# EAGLE design first_draft_schematic (EAGLE 7.2.0)
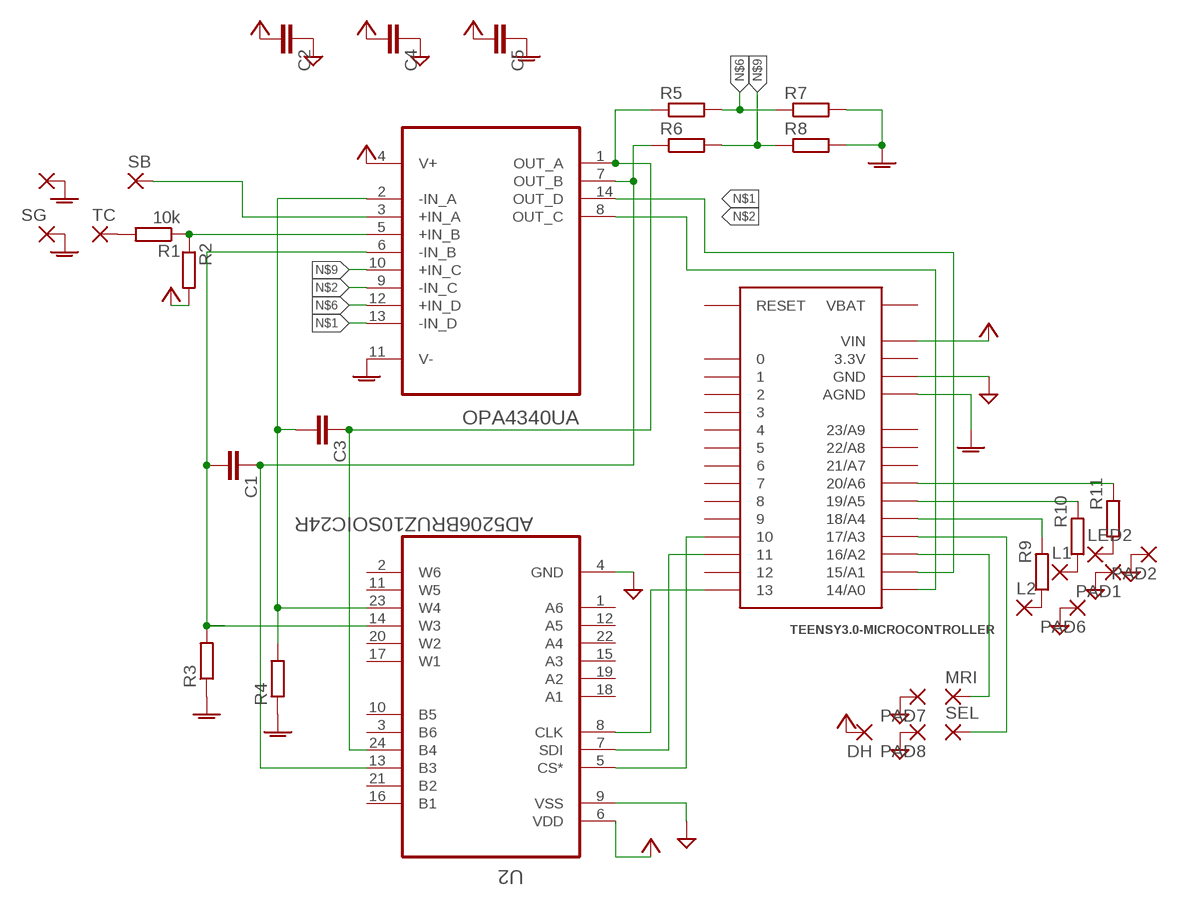
[diagram p0: schematic, sheet 1]

## Parts
C1  10pF  C-EUC0805  [C0805]
C2  0.1uF  C-EUC0805  [C0805]
C3  10pF  C-EUC0805  [C0805]
C4  0.1uF  C-EUC0805  [C0805]
C5  0.1uF  C-EUC0805  [C0805]
DH  WIREPAD1,6/0,9  [1,6/0,9]
L1  WIREPAD1,6/0,9  [1,6/0,9]
L2  WIREPAD1,6/0,9  [1,6/0,9]
LED2  WIREPAD1,6/0,9  [1,6/0,9]
MRI  WIREPAD1,6/0,9  [1,6/0,9]
PAD1  WIREPAD1,6/0,9  [1,6/0,9]
PAD2  WIREPAD1,6/0,9  [1,6/0,9]
PAD6  WIREPAD1,6/0,9  [1,6/0,9]
PAD7  WIREPAD1,6/0,9  [1,6/0,9]
PAD8  WIREPAD1,6/0,9  [1,6/0,9]
R1  10k  R-EU_R0805  [R0805]
R2  10k  R-EU_R0805  [R0805]
R3  5k  R-EU_R0805  [R0805]
R4  5k  R-EU_R0805  [R0805]
R5  12k  R-EU_R0805  [R0805]
R6  12k  R-EU_R0805  [R0805]
R7  23.2k  R-EU_R0805  [R0805]
R8  23.2k  R-EU_R0805  [R0805]
R9  681  R-EU_R0805  [R0805]
R10  681  R-EU_R0805  [R0805]
R11  681  R-EU_R0805  [R0805]
SB  SAMBA  WIREPAD1,6/0,9  [1,6/0,9]
SEL  WIREPAD1,6/0,9  [1,6/0,9]
SG  WIREPAD1,6/0,9  [1,6/0,9]
TC  WIREPAD1,6/0,9  [1,6/0,9]
TEENSY3.0-MICROCONTROLLER  TEENSY_3.0_BASIC-PGM  [TEENSY_3.0_BASIC-PGM]
TG  WIREPAD1,6/0,9  [1,6/0,9]
U1  OPA4340UA  [SOIC127P600X175-14N]
U2  AD5206BRUZ10SOIC24R  [SO24R]

## Nets
AGND: C5.1 R3.1 R4.1 R7.2 R8.2 SG.1(P) TEENSY3.0-MICROCONTROLLER.AGND TG.1(P) U1.11(V-)
GND: C2.1 C4.1 PAD1.1(P) PAD2.1(P) PAD6.1(P) PAD7.1(P) PAD8.1(P) TEENSY3.0-MICROCONTROLLER.GND TEENSY3.0-MICROCONTROLLER.GND1(GND) U2.4(GND) U2.9(VSS)
N$1: TEENSY3.0-MICROCONTROLLER.15/A1 U1.13(-IN_D) U1.14(OUT_D)
N$2: TEENSY3.0-MICROCONTROLLER.14/A0 U1.8(OUT_C) U1.9(-IN_C)
N$3: C3.2 R4.2 U1.2(-IN_A) U2.23(W4)
N$4: R1.1 R2.1 U1.5(+IN_B)
N$5: C3.1 R5.1 U1.1(OUT_A) U2.24(B4)
N$6: R5.2 R7.1 U1.12(+IN_D)
N$7: TEENSY3.0-MICROCONTROLLER.10 U2.5(CS*)
N$8: TEENSY3.0-MICROCONTROLLER.11 U2.7(SDI)
N$9: R6.2 R8.1 U1.10(+IN_C)
N$10: SB.1(P) U1.3(+IN_A)
N$11: L2.1(P) R9.1
N$12: C1.2 R3.2 U1.6(-IN_B) U2.14(W3)
N$13: R1.2 TC.1(P)
N$14: R9.2 TEENSY3.0-MICROCONTROLLER.18/A4
N$15: MRI.1(P) TEENSY3.0-MICROCONTROLLER.16/A2
N$16: SEL.1(P) TEENSY3.0-MICROCONTROLLER.17/A3
N$17: C1.1 R6.1 U1.7(OUT_B) U2.13(B3)
N$18: L1.1(P) R10.1
N$19: TEENSY3.0-MICROCONTROLLER.13 U2.8(CLK)
N$21: R10.2 TEENSY3.0-MICROCONTROLLER.19/A5
N$22: LED2.1(P) R11.1
N$23: R11.2 TEENSY3.0-MICROCONTROLLER.20/A6
VCC: C2.2 C4.2 C5.2 DH.1(P) R2.2 TEENSY3.0-MICROCONTROLLER.VIN U1.4(V+) U2.6(VDD)
Unconnected: TEENSY3.0-MICROCONTROLLER.0 TEENSY3.0-MICROCONTROLLER.1 TEENSY3.0-MICROCONTROLLER.2 TEENSY3.0-MICROCONTROLLER.3 TEENSY3.0-MICROCONTROLLER.4 TEENSY3.0-MICROCONTROLLER.5 TEENSY3.0-MICROCONTROLLER.6 TEENSY3.0-MICROCONTROLLER.7 TEENSY3.0-MICROCONTROLLER.8 TEENSY3.0-MICROCONTROLLER.9 TEENSY3.0-MICROCONTROLLER.12 TEENSY3.0-MICROCONTROLLER.21/A7 TEENSY3.0-MICROCONTROLLER.22/A8 TEENSY3.0-MICROCONTROLLER.23/A9 TEENSY3.0-MICROCONTROLLER.RESET U2.1(A6) U2.2(W6) U2.3(B6) U2.10(B5) U2.11(W5) U2.12(A5) U2.15(A3) U2.16(B1) U2.17(W1) U2.18(A1) U2.19(A2) U2.20(W2) U2.21(B2) U2.22(A4)

## Power pins joined to a net without a drawn wire
3.3V: TEENSY3.0-MICROCONTROLLER.3.3V TEENSY3.0-MICROCONTROLLER.3.3V1(3.3V)
VBAT: TEENSY3.0-MICROCONTROLLER.VBAT

## Library data of the parts
C1-C5 = resistor:C-EU: CAPACITOR, European symbol
DH L1 L2 LED2 MRI PAD1 PAD2 PAD6-PAD8 SB SEL SG TC TG = wirepad:WIREPAD: Wire PAD connect wire on PCB
R1-R11 = resistor:R-EU_: RESISTOR, European symbol
TEENSY3.0-MICROCONTROLLER = Teensy3.0:TEENSY_3.0_BASIC-PGM: Teensy 3.0 Board outline identical to other 'basic' version except that 'PGM' pin has been omitted. See '+4', 'AllAnalogPins", and 'AllPins' packages for additional pin holes, as needed.
U1 = Texas Instruments_By_element14_Batch_1:OPA4340UA: OPERATIONAL AMPLIFIERS; MPN: OPA4340UA; OC_FARNELL: 1212307; OC_NEWARK: 35C1907; PACKAGE: SOIC-14; SUPPLIER: Texas Instruments
U2 = AD5206_SOIC:AD5206BRUZ10: 6-Channel, 256-Position Digital Potentiometer

## Board
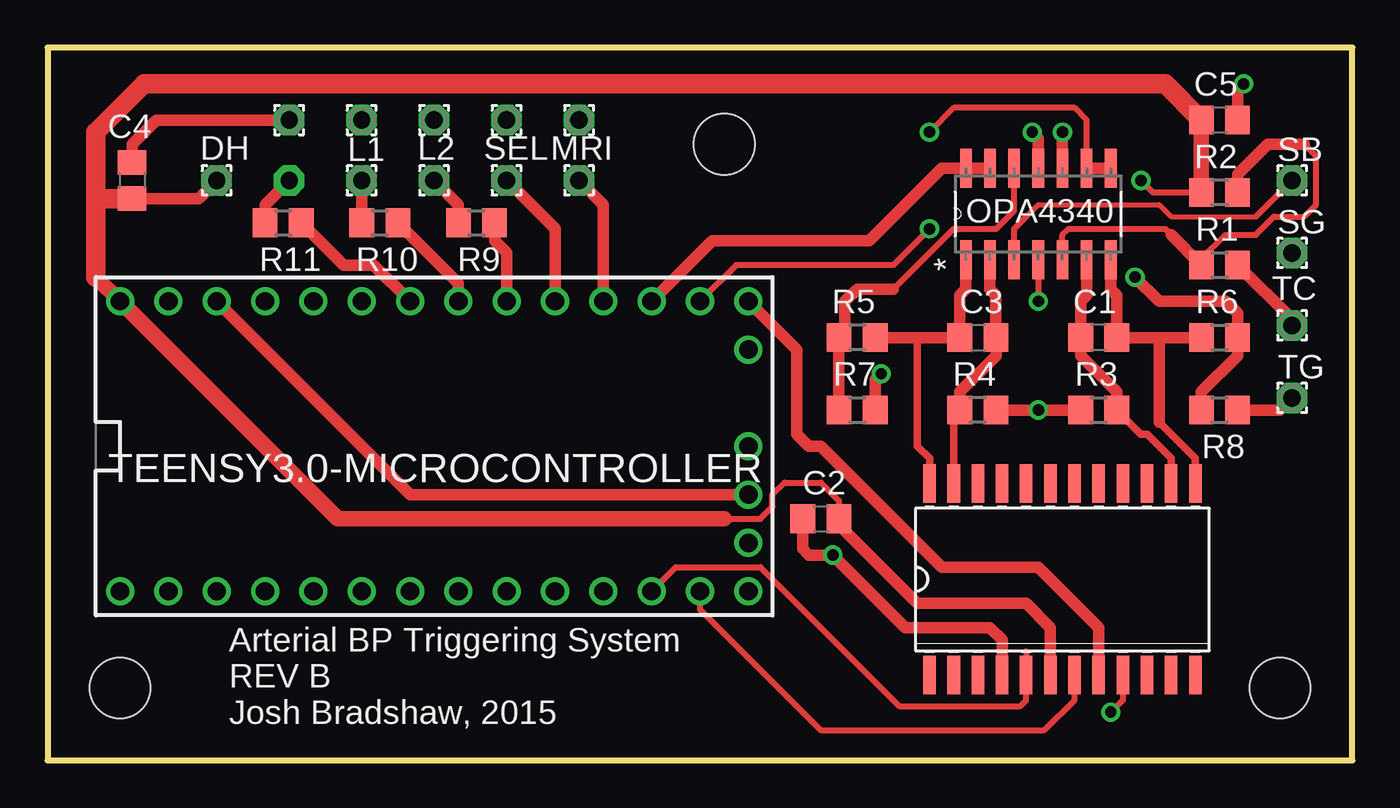
[diagram p1: board, top side]
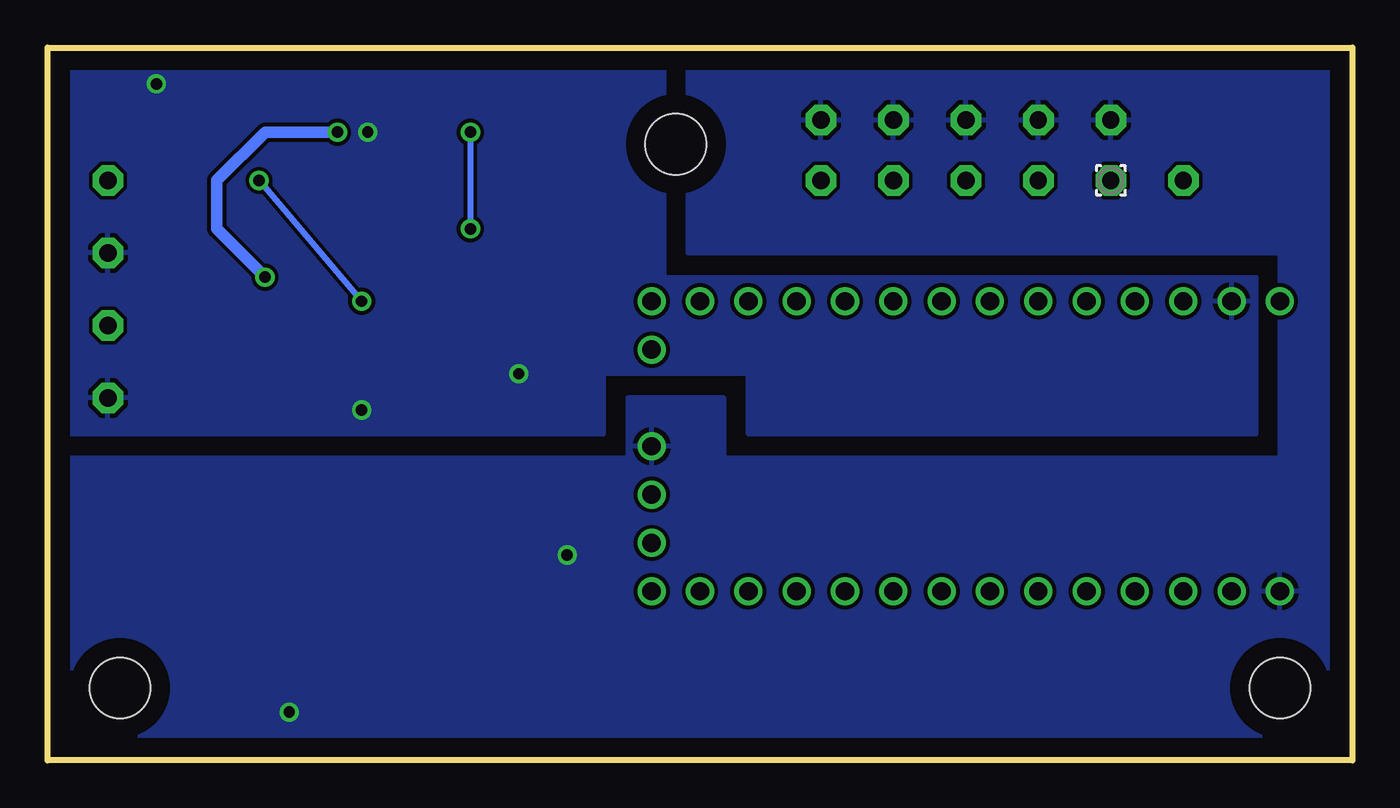
[diagram p2: board, bottom side, seen from below]

Size 68.58 x 37.47 mm. Coordinates in mm from the lower left corner, seen from the top.
Outline: 0,37.47 0,0 68.58,0 68.58,37.47 0,37.47
Copper layers (1*16): Top 0.035mm / dielectric 1.5mm / Bottom 0.035mm
Design rules "default *": minimum track width 10mil, minimum drill 23mil, track to track 8mil, track to pad 8mil, pad to pad 8mil, via to via 8mil, smd to smd 8mil, copper to edge 40mil, drill to drill 8mil, minimum pad ring 10mil, minimum via ring 8mil, stop-mask expansion 4mil, vias tented up to drill 0mil, thermal gap 10mil
Holes 3.2 mm at 3.81,3.81 64.77,3.81 35.56,32.39

### Footprints (pad centres in the part's own frame; a part is rotated, then mirrored left to right if it is on the bottom)
C0805 = smd 1.3 x 1.5: 1 -0.95,0; 2 0.95,0
1,6/0,9 = drill 0.914 pad 1.6 octagon: 1 0,0
R0805 = smd 1.3 x 1.5: 1 -0.95,0; 2 0.95,0
TEENSY_3.0_BASIC-PGM = drill 0.965: 0 -7.62,13.97; 1 -7.62,11.43; 2 -7.62,8.89; 3 -7.62,6.35; 3.3V 7.62,11.43; 3.3V1 -2.54,-16.51; 4 -7.62,3.81; 5 -7.62,1.27; 6 -7.62,-1.27; 7 -7.62,-3.81; 8 -7.62,-6.35; 9 -7.62,-8.89; 10 -7.62,-11.43; 11 -7.62,-13.97; 12 -7.62,-16.51; 13 7.62,-16.51; 14/A0 7.62,-13.97; 15/A1 7.62,-11.43; 16/A2 7.62,-8.89; 17/A3 7.62,-6.35; 18/A4 7.62,-3.81; 19/A5 7.62,-1.27; 20/A6 7.62,1.27; 21/A7 7.62,3.81; 22/A8 7.62,6.35; 23/A9 7.62,8.89; AGND 7.62,13.97; GND -7.62,16.51; GND1 0,-16.51; RESET 5.08,-16.51; VBAT -5.08,-16.51; VIN 7.62,16.51
SOIC127P600X175-14N = smd 2.057 x 0.61: 1 -4.801,7.62; 2 -4.801,6.35; 3 -4.801,5.08; 4 -4.801,3.81; 5 -4.801,2.54; 6 -4.801,1.27; 7 -4.801,0; 8 0,0; 9 0,1.27; 10 0,2.54; 11 0,3.81; 12 0,5.08; 13 0,6.35; 14 0,7.62
SO24R = smd 0.66 x 2.032: 1 -6.985,-5.029; 2 -5.715,-5.029; 3 -4.445,-5.029; 4 -3.175,-5.029; 5 -1.905,-5.029; 6 -0.635,-5.029; 7 0.635,-5.029; 8 1.905,-5.029; 9 3.175,-5.029; 10 4.445,-5.029; 11 5.715,-5.029; 12 6.985,-5.029; 13 6.985,5.029; 14 5.715,5.029; 15 4.445,5.029; 16 3.175,5.029; 17 1.905,5.029; 18 0.635,5.029; 19 -0.635,5.029; 20 -1.905,5.029; 21 -3.175,5.029; 22 -4.445,5.029; 23 -5.715,5.029; 24 -6.985,5.029

### Placement (x,y rotation side)
C1  55.24,22.23 180 top
C2  40.64,12.7 0 top
C3  48.89,22.23 0 top
C4  4.45,30.48 270 top
C5  61.59,33.66 180 top
DH  8.89,30.48 270 top
L1  16.51,30.48 0 top
L2  20.32,30.48 270 top
LED2  12.7,30.48 0 bottom
MRI  27.94,30.48 270 top
PAD1  20.32,33.66 0 top
PAD2  16.51,33.66 0 top
PAD6  12.7,33.66 270 top
PAD7  24.13,33.66 270 top
PAD8  27.94,33.66 270 top
R1  61.59,26.04 0 top
R2  61.59,29.84 180 top
R3  55.24,18.41 0 top
R4  48.89,18.41 180 top
R5  42.54,22.23 180 top
R6  61.59,22.23 0 top
R7  42.54,18.41 0 top
R8  61.59,18.41 0 top
R9  22.54,28.26 0 top
R10  17.46,28.26 0 top
R11  12.38,28.26 0 top
SB  65.41,30.48 0 top
SEL  24.13,30.48 270 top
SG  65.41,26.67 0 top
TC  65.41,22.86 0 top
TEENSY3.0-MICROCONTROLLER  20.32,16.51 90 top
TG  65.41,19.05 0 top
U1  55.88,31.12 90 top
U2  53.34,9.53 0 top

### Tracks (layer width: path | path; a pad name or v marks a point on that pad's centre or on a via)
3.3V
  Top 0.61: TEENSY3.0-MICROCONTROLLER.3.3V1 19.05,13.97 TEENSY3.0-MICROCONTROLLER.3.3V
AGND  (via drill 0.6, 0.6 pad 0.25)
  Top 0.61: C5.1 62.54,35.24 v62.86,35.56 | R7.2 43.49,20 v43.81,20.32 | R4.1 v52.07,18.41 R3.1 | U1.11 52.07,32.7 v51.75,33.02 | R8.2 64.77,18.41 TG.1
  pour Bottom: 5.08,25.4 5.08,17.14 31.75,17.14 31.75,20.32 39.37,20.32 39.37,17.14 69.22,17.14 69.22,38.1 36.2,38.1 36.2,25.4
GND  (via drill 0.6)
  Top 0.305: U2.9 56.52,3.18 v55.88,2.54
  Top 0.61: C4.1 4.45,32.39 5.71,33.66 PAD6.1 | C2.1 39.69,11.43 39.69,11.11 40,10.79 v41.27,10.79 45.09,6.99 49.53,6.99 50.16,6.35 U2.4
  pour Bottom: 69.22,15.88 69.22,-0.63 0,-0.63 0,38.1 34.92,38.1 34.92,26.67 3.81,26.67 3.81,15.88 33.02,15.88 33.02,19.05 38.1,19.05 38.1,15.88
N$1
  Top 0.61: U1.13 U1.14 46.99,31.12 43.18,27.3 34.92,27.3 TEENSY3.0-MICROCONTROLLER.15/A1
N$2  (via drill 0.6)
  Top 0.305: U1.9 54.61,33.66 53.98,34.29 47.62,34.29 v46.35,33.02 | v46.35,27.94 44.45,26.04 36.2,26.04 TEENSY3.0-MICROCONTROLLER.14/A0
  Top 0.61: U1.9 U1.8
  Bottom 0.305: v46.35,33.02 v46.35,27.94
N$3
  Top 0.406: U2.23 47.62,18.09 R4.2
  Top 0.61: R4.2 47.95,19.37 49.85,21.27 C3.2 49.84,24.45 49.53,24.77 U1.2
N$4
  Top 0.254: R1.1 60.64,26.36 | R2.1 62.54,30.16
  Top 0.305: 60.64,26.36 61.91,27.62 63.5,27.62 64.45,28.57 66.04,28.57 66.68,29.21 66.68,31.75 66.04,32.39 | U1.5 53.34,27.62 53.66,27.94 58.74,27.94 59.05,27.62
  Top 0.61: 62.54,30.16 62.54,30.8 64.14,32.39 66.04,32.39 | R1.1 59.05,27.62
N$5
  Top 0.406: U2.24 46.35,15.88 45.72,16.51 45.72,22.23
  Top 0.61: U1.1 48.26,24.77 47.95,24.45 C3.1 45.72,22.23 R5.1
N$6
  Top 0.254: R5.2 41.91,22.23
  Top 0.305: 44.45,24.77 47.62,27.94 49.85,27.94 50.8,28.89 U1.12
  Top 0.61: R7.1 R5.2 | 41.91,22.23 41.91,24.13 42.54,24.77 44.45,24.77
N$7
  Top 0.305: TEENSY3.0-MICROCONTROLLER.10 33.02,10.16 37.46,10.16 44.77,2.86 51.12,2.86 51.43,3.18 U2.5 51.43,5.71
N$8
  Top 0.305: TEENSY3.0-MICROCONTROLLER.11 34.29,7.94 40.64,1.59 52.39,1.59 53.98,3.18 U2.7
N$9  (via drill 0.6)
  Top 0.61: v57.15,25.4 58.42,24.13 61.91,24.13 62.55,23.5 R6.2 62.55,21.27 60.64,19.37 R8.1 | U1.10 v53.34,33.02
  Bottom 0.61: v57.15,25.4 59.69,27.94 59.69,30.48 57.15,33.02 v53.34,33.02
N$10
  Top 0.254: 51.43,28.57 52.07,29.21 58.42,29.21 59.05,28.57 63.5,28.57
  Top 0.305: U1.3 50.8,27.94 51.43,28.57 | 63.5,28.57 SB.1
N$11
  Top 0.61: R9.1 21.59,29.21 L2.1
N$12
  Top 0.406: U2.14 59.05,15.88 57.78,17.14 57.46,17.14 R3.2
  Top 0.61: R3.2 56.2,19.37 54.29,21.27 C1.2 54.29,24.13 54.61,24.45 U1.6
N$13
  Top 0.61: 62.86,26.04 R1.2 65.41,23.18 TC.1
N$14
  Top 0.61: TEENSY3.0-MICROCONTROLLER.18/A4 24.13,26.67 23.5,27.3 R9.2
N$15
  Top 0.61: TEENSY3.0-MICROCONTROLLER.16/A2 29.21,29.21 MRI.1
N$16
  Top 0.61: TEENSY3.0-MICROCONTROLLER.17/A3 26.67,27.94 SEL.1
N$17
  Top 0.254: C1.1
  Top 0.406: U2.13 60.32,15.88 58.42,17.78
  Top 0.61: 58.42,22.23 C1.1 56.2,24.45 55.88,24.77 U1.7 | 58.42,22.23 R6.1 | 58.42,17.78 58.42,22.23
N$18
  Top 0.61: R10.1 L1.1
N$19
  Top 0.61: TEENSY3.0-MICROCONTROLLER.13 39.37,21.59 39.37,17.14 40,16.51 40.64,16.51 46.99,10.16 52.07,10.16 55.24,6.99 U2.8
N$21
  Top 0.61: TEENSY3.0-MICROCONTROLLER.19/A5 21.59,25.08 R10.2
N$22
  Top 0.61: R11.1 11.43,29.21 LED2.1
N$23
  Top 0.61: TEENSY3.0-MICROCONTROLLER.20/A6 17.15,26.04 15.55,26.04 R11.2
VCC  (via drill 0.6)
  Top 0.305: 35.56,12.7 37.46,12.7 38.1,13.34 38.1,13.97 38.73,14.61 40.64,14.61 41.59,13.65 C2.2 | U1.4 v52.07,24.13 | R2.2 58.1,29.84 v57.47,30.48
  Top 0.61: 60.33,33.34 C5.2 | C4.2 7.94,29.53 DH.1 | C2.2 41.59,12.39 45.72,8.26 51.43,8.26 52.7,6.99 U2.6
  Top 0.813: R2.2 C5.2 | 2.54,25.4 TEENSY3.0-MICROCONTROLLER.VIN 15.24,12.7 35.56,12.7 | 2.54,29.53
  Top 1.016: 2.54,25.4 2.54,29.53 2.54,33.02 5.08,35.56 58.74,35.56 C5.2 | 2.54,29.53 C4.2
  Bottom 0.305: v57.47,30.48 v52.07,24.13

### Text on the board
tNames: OPA4340 | Arterial BP Triggering System / REV B / Josh Bradshaw, 2015